# Altium schematic sheet Interfaces.SchDoc: Interfaces
size A3; Author: Valentin Py; DrawnBy: Valentin Py; Engineer: Valentin Py; Address1: valentin.py@gmail.com; SheetNumber: 3; SheetTotal: 5; PageSetup: Record=PageOptions|CenterHorizontal=True|CenterVertical=True|PrintScale=0.24|XCorrection=1.00|YCorrection=1.00|PrintKind=0|BorderSize=5000000|LeftOffset=0|BottomOffset=0|Orientation=2|PaperLength=1000|PaperWidth=1000|Scale=100|PaperSource=7|PrintQuality=-4|MediaType=1|DitherType=10|PaperKind=A4|PrintScaleMode=1
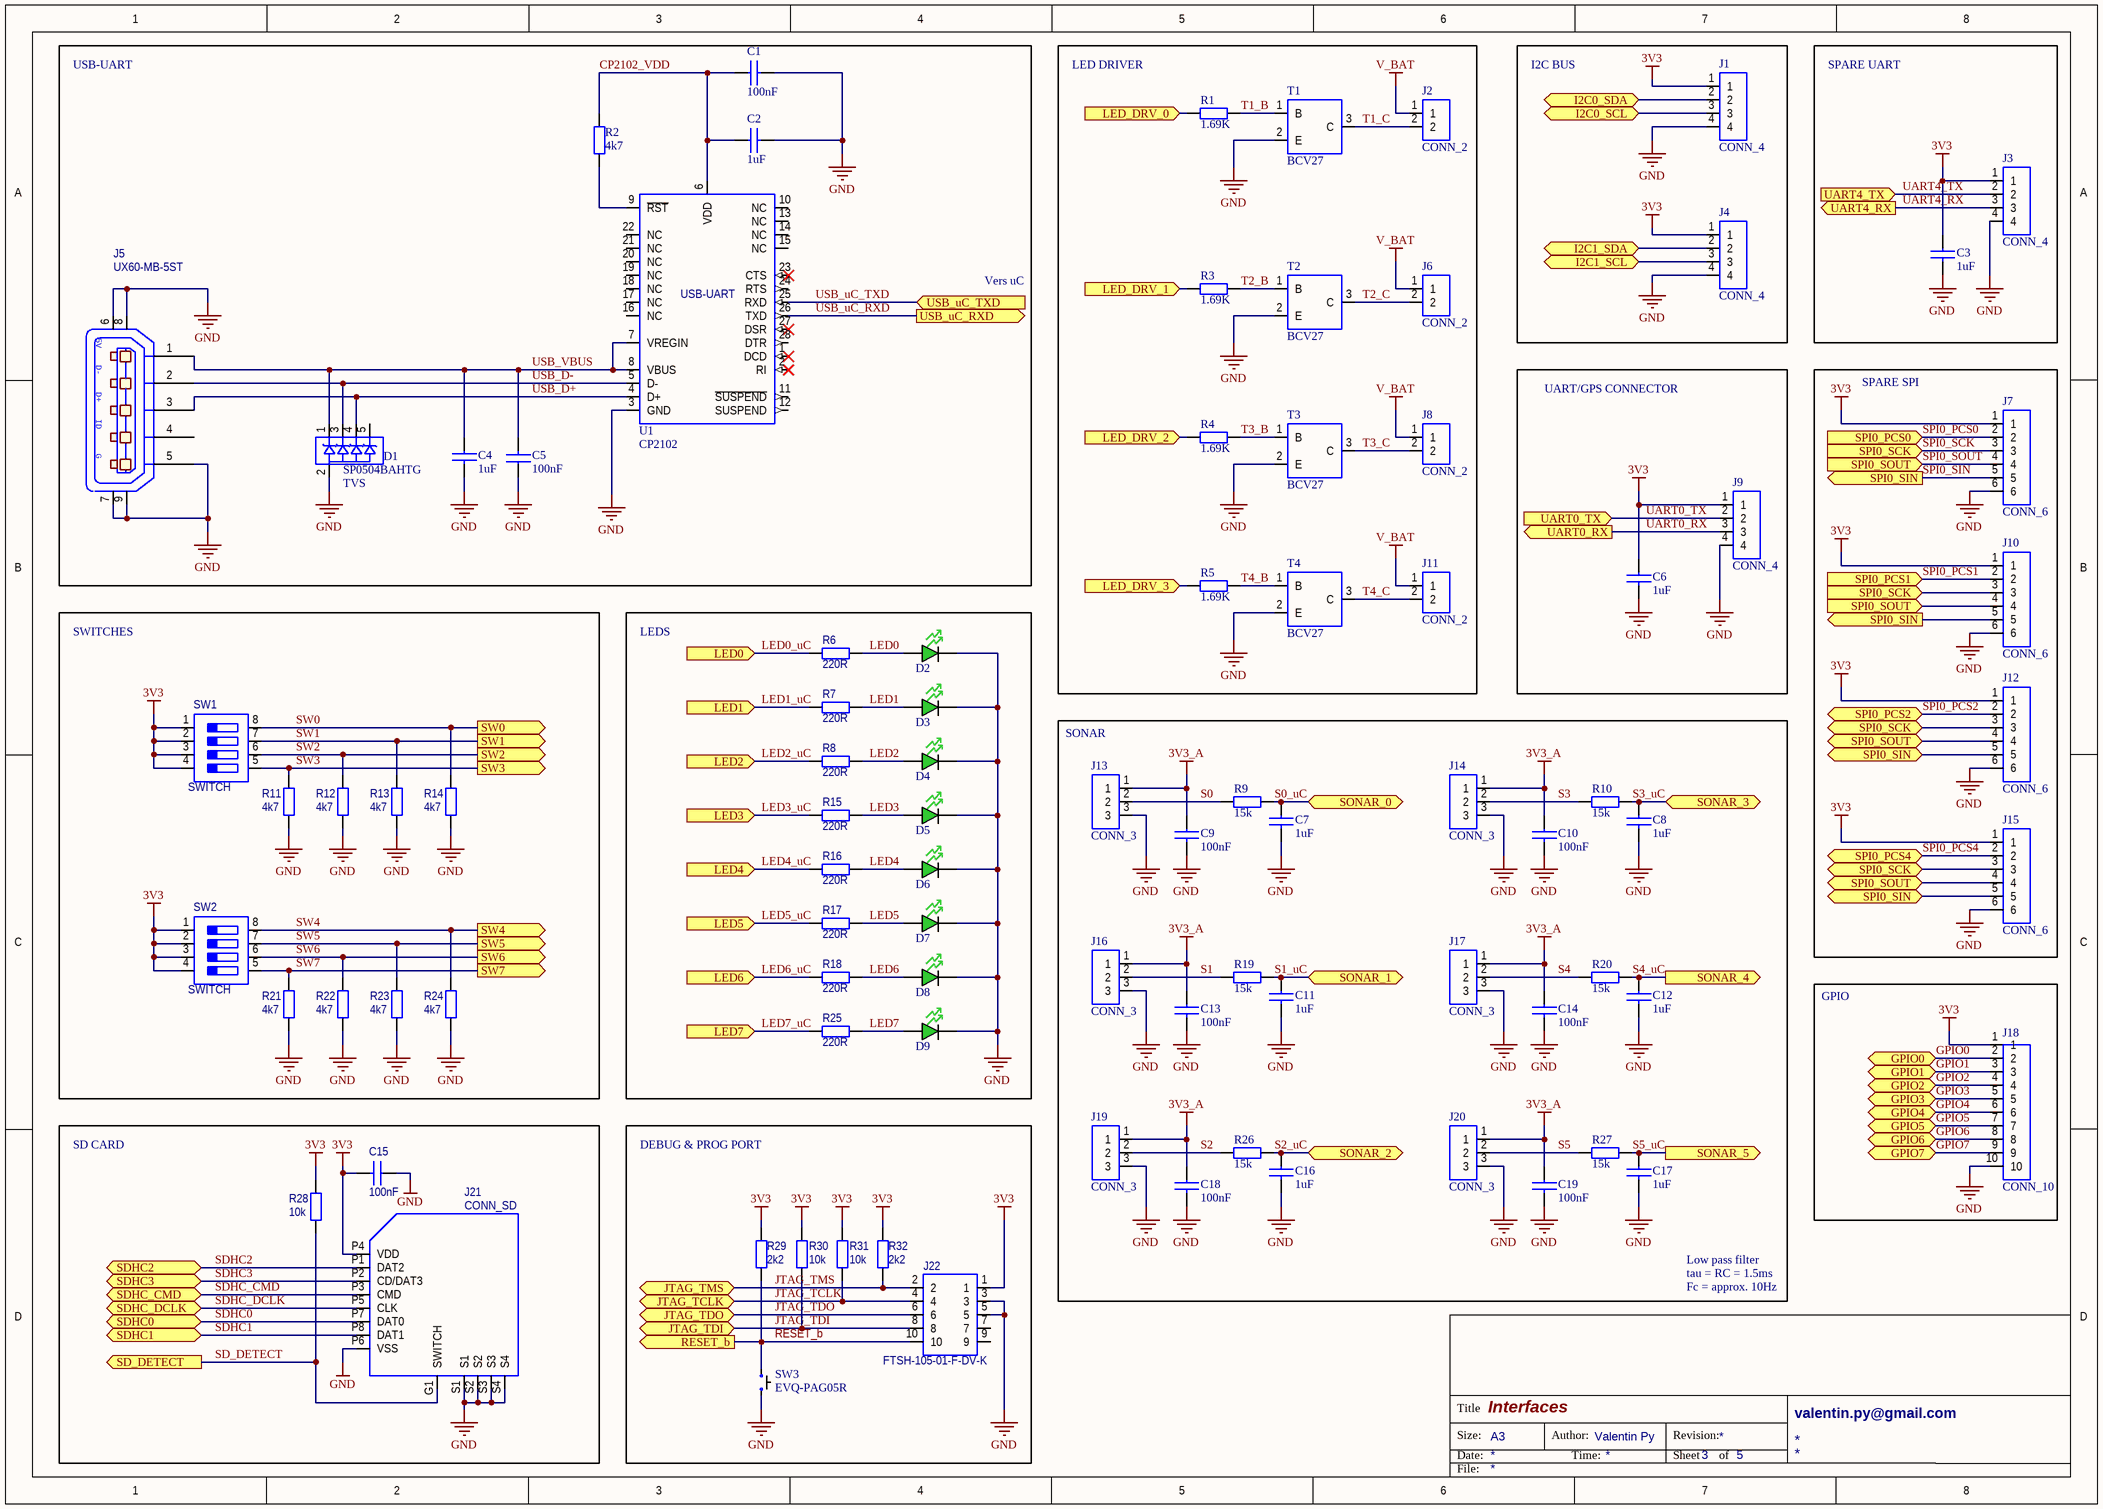
[diagram p0: Interfaces.SchDoc]

## Parts
C1  100nF  [080503]
C2  1uF  [080503]
C3  1uF  [080503]
C4  1uF  [080503]
C5  100nF  [080503]
C6  1uF  [080503]
C7  1uF  [080503]
C8  1uF  [080503]
C9  100nF  [080503]
C10  100nF  [080503]
C11  1uF  [080503]
C12  1uF  [080503]
C13  100nF  [080503]
C14  100nF  [080503]
C15  100nF  [080503]
C16  1uF  [080503]
C17  1uF  [080503]
C18  100nF  [080503]
C19  100nF  [080503]
D1  SP0504BAHTG  [SOT23501]
D2  LED  [LED_0805 - GREEN]  (value not drawn)
D3  LED  [LED_0805 - GREEN]  (value not drawn)
D4  LED  [LED_0805 - GREEN]  (value not drawn)
D5  LED  [LED_0805 - GREEN]  (value not drawn)
D6  LED  [LED_0805 - GREEN]  (value not drawn)
D7  LED  [LED_0805 - GREEN]  (value not drawn)
D8  LED  [LED_0805 - GREEN]  (value not drawn)
D9  LED  [LED_0805 - GREEN]  (value not drawn)
J1  CONN_4  [640454-4]
J2  CONN_2  [640454-2]
J3  CONN_4  [640454-4]
J4  CONN_4  [640454-4]
J5  UX60-MB-5ST  [USB/UX60-MB-5ST]
J6  CONN_2  [640454-2]
J7  CONN_6  [640454-6]
J8  CONN_2  [640454-2]
J9  CONN_4  [640454-4]
J10  CONN_6  [640454-6]
J11  CONN_2  [640454-2]
J12  CONN_6  [640454-6]
J13  CONN_3  [640454-3]
J14  CONN_3  [640454-3]
J15  CONN_6  [640454-6]
J16  CONN_3  [640454-3]
J17  CONN_3  [640454-3]
J18  CONN_10  [640454-10]
J19  CONN_3  [640454-3]
J20  CONN_3  [640454-3]
J21  CONN_SD  [con8_sdcard_push_sm]
J22  FTSH-105-01-F-DV-K  [FTSH-105-01-F-DV-K]
R1  1.69k  [060301]
R2  4k7  [060301]
R3  1.69k  [060301]
R4  1.69k  [060301]
R5  1.69k  [060301]
R6  220R  [060301]
R7  220R  [060301]
R8  220R  [060301]
R9  15k  [060301]
R10  15k  [060301]
R11  4k7  [060301]
R12  4k7  [060301]
R13  4k7  [060301]
R14  4k7  [060301]
R15  220R  [060301]
R16  220R  [060301]
R17  220R  [060301]
R18  220R  [060301]
R19  15k  [060301]
R20  15k  [060301]
R21  4k7  [060301]
R22  4k7  [060301]
R23  4k7  [060301]
R24  4k7  [060301]
R25  220R  [060301]
R26  15k  [060301]
R27  15k  [060301]
R28  10k  [060301]
R29  2k2  [060301]
R30  10k  [060301]
R31  10k  [060301]
R32  2k2  [060301]
SW1  SWITCH  [GDS04]
SW2  SWITCH  [GDS04]
SW3  EVQ-PAG05R  [EVQ-PAG05R]
T1  BCV27  [BCV27]
T2  BCV27  [BCV27]
T3  BCV27  [BCV27]
T4  BCV27  [BCV27]
U1  CP2102  [QFN-28]

## Blocks framed on the sheet
LED DRIVER: J2 J6 J8 J11 R1 R3-R5 T1-T4
I2C BUS: J1 J4
UART/GPS CONNECTOR: C6 J9
SPARE SPI: J7 J10 J12 J15
SWITCHES: R11-R14 R21-R24 SW1 SW2
LEDS: D2-D9 R6-R8 R15-R18 R25
GPIO: J18
SD CARD: C15 J21 R28
DEBUG & PROG PORT: J22 R29-R32 SW3

## Ports
GPIO0 (bidir), GPIO1 (bidir), GPIO2 (bidir), GPIO3 (bidir), GPIO4 (bidir), GPIO5 (bidir), GPIO6 (bidir), GPIO7 (bidir), I2C0_SCL (bidir), I2C0_SDA (bidir), I2C1_SCL, I2C1_SDA, JTAG_TCLK, JTAG_TDI, JTAG_TDO, JTAG_TMS, LED0 (in), LED1 (in), LED2 (in), LED3 (in), LED4 (in), LED5 (in), LED6 (in), LED7 (in), LED_DRV_0 (in), LED_DRV_1 (in), LED_DRV_2 (in), LED_DRV_3 (in), RESET_b (out), SD_DETECT (out), SDHC0, SDHC1, SDHC2, SDHC3, SDHC_CMD, SDHC_DCLK, SONAR_0, SONAR_1, SONAR_2, SONAR_3, SONAR_4 (out), SONAR_5 (out), SPI0_PCS0 (in), SPI0_PCS1 (in), SPI0_PCS2, SPI0_PCS4, SPI0_SCK, SPI0_SCK (in), SPI0_SIN, SPI0_SIN (out), SPI0_SOUT, SPI0_SOUT (in), SW0 (out), SW1 (out), SW2 (out), SW3 (out), SW4 (out), SW5 (out), SW6 (out), SW7 (out), UART0_RX (out), UART0_TX (in), UART4_RX (out), UART4_TX (in), USB_uC_RXD (out), USB_uC_TXD (in)

## Nets
3V3: C3.1 C6.1 C15.2 J1.1 J3.1 J4.1 J7.1 J9.1 J10.1 J12.1 J15.1 J18.1 J21.P4(VDD) J22.1 R28.1 R29.2 R30.1 R31.1 R32.2 SW1.1 SW1.2 SW1.3 SW1.4 SW2.1 SW2.2 SW2.3 SW2.4
3V3_A: C9.1 C10.1 C13.1 C14.1 C18.1 C19.1 J13.1 J14.1 J16.1 J17.1 J19.1 J20.1
GND: C1.2 C2.2 C3.2 C4.2 C5.1 C6.2 C7.2 C8.2 C9.2 C10.2 C11.2 C12.2 C13.2 C14.2 C15.1 C16.2 C17.2 C18.2 C19.2 D1.2 D2.C D3.C D4.C D5.C D6.C D7.C D8.C D9.C J1.4 J3.4 J4.4 J5.5(P5) J5.6(SHLD1) J5.7(SHLD2) J5.8(SHLD3) J5.9(SHLD4) J7.6 J9.4 J10.6 J12.6 J13.3 J14.3 J15.6 J16.3 J17.3 J18.10 J19.3 J20.3 J21.P6(VSS) J21.S1 J21.S2 J21.S3 J21.S4 J22.3 J22.5 R11.1 R12.1 R13.1 R14.1 R21.1 R22.1 R23.1 R24.1 SW3.B T1.2(E) T2.2(E) T3.2(E) T4.2(E) U1.3(GND)
V_BAT: J2.1 J6.1 J8.1 J11.1
CP2102_VDD: C1.1 C2.1 R2.2 U1.6(VDD)
GPIO0: J18.2 ; port GPIO0
GPIO1: J18.3 ; port GPIO1
GPIO2: J18.4 ; port GPIO2
GPIO3: J18.5 ; port GPIO3
GPIO4: J18.6 ; port GPIO4
GPIO5: J18.7 ; port GPIO5
GPIO6: J18.8 ; port GPIO6
GPIO7: J18.9 ; port GPIO7
I2C0_SCL: J1.3 ; port I2C0_SCL
I2C0_SDA: J1.2 ; port I2C0_SDA
I2C1_SCL: J4.3 ; port I2C1_SCL
I2C1_SDA: J4.2 ; port I2C1_SDA
JTAG_TCLK: J22.4 R31.2 ; port JTAG_TCLK
JTAG_TDI: J22.8 R30.2 ; port JTAG_TDI
JTAG_TDO: J22.6 ; port JTAG_TDO
JTAG_TMS: J22.2 R32.1 ; port JTAG_TMS
LED0: D2.A R6.2
LED0_uC: R6.1 ; port LED0
LED1: D3.A R7.2
LED1_uC: R7.1 ; port LED1
LED2: D4.A R8.2
LED2_uC: R8.1 ; port LED2
LED3: D5.A R15.2
LED3_uC: R15.1 ; port LED3
LED4: D6.A R16.2
LED4_uC: R16.1 ; port LED4
LED5: D7.A R17.2
LED5_uC: R17.1 ; port LED5
LED6: D8.A R18.2
LED6_uC: R18.1 ; port LED6
LED7: D9.A R25.2
LED7_uC: R25.1 ; port LED7
LED_DRV_0: R1.1 ; port LED_DRV_0
LED_DRV_1: R3.1 ; port LED_DRV_1
LED_DRV_2: R4.1 ; port LED_DRV_2
LED_DRV_3: R5.1 ; port LED_DRV_3
RESET_b: J22.10 R29.1 SW3.A ; port RESET_b
S0: J13.2 R9.1
S0_uC: C7.1 R9.2 ; port SONAR_0
S1: J16.2 R19.1
S1_uC: C11.1 R19.2 ; port SONAR_1
S2: J19.2 R26.1
S2_uC: C16.1 R26.2 ; port SONAR_2
S3: J14.2 R10.1
S3_uC: C8.1 R10.2 ; port SONAR_3
S4: J17.2 R20.1
S4_uC: C12.1 R20.2 ; port SONAR_4
S5: J20.2 R27.1
S5_uC: C17.1 R27.2 ; port SONAR_5
SD_DETECT: J21.G1(SWITCH) R28.2 ; port SD_DETECT
SDHC0: J21.P7(DAT0) ; port SDHC0
SDHC1: J21.P8(DAT1) ; port SDHC1
SDHC2: J21.P1(DAT2) ; port SDHC2
SDHC3: J21.P2(CD/DAT3) ; port SDHC3
SDHC_CMD: J21.P3(CMD) ; port SDHC_CMD
SDHC_DCLK: J21.P5(CLK) ; port SDHC_DCLK
SPI0_PCS0: J7.2 ; port SPI0_PCS0
SPI0_PCS1: J10.2 ; port SPI0_PCS1
SPI0_PCS2: J12.2 ; port SPI0_PCS2
SPI0_PCS4: J15.2 ; port SPI0_PCS4
SPI0_SCK: J7.3 J10.3 J12.3 J15.3 ; port SPI0_SCK
SPI0_SIN: J7.5 J10.5 J12.5 J15.5 ; port SPI0_SIN
SPI0_SOUT: J7.4 J10.4 J12.4 J15.4 ; port SPI0_SOUT
SW0: R14.2 SW1.8 ; port SW0
SW1: R13.2 SW1.7 ; port SW1
SW2: R12.2 SW1.6 ; port SW2
SW3: R11.2 SW1.5 ; port SW3
SW4: R24.2 SW2.8 ; port SW4
SW5: R23.2 SW2.7 ; port SW5
SW6: R22.2 SW2.6 ; port SW6
SW7: R21.2 SW2.5 ; port SW7
T1_B: R1.2 T1.1(B)
T1_C: J2.2 T1.3(C)
T2_B: R3.2 T2.1(B)
T2_C: J6.2 T2.3(C)
T3_B: R4.2 T3.1(B)
T3_C: J8.2 T3.3(C)
T4_B: R5.2 T4.1(B)
T4_C: J11.2 T4.3(C)
UART0_RX: J9.3 ; port UART0_RX
UART0_TX: J9.2 ; port UART0_TX
UART4_RX: J3.3 ; port UART4_RX
UART4_TX: J3.2 ; port UART4_TX
USB_D+: D1.4 J5.3(P3) U1.4(D+)
USB_D-: D1.3 J5.2(P2) U1.5(D-)
USB_uC_RXD: U1.26(TXD) ; port USB_uC_RXD
USB_uC_TXD: U1.25(RXD) ; port USB_uC_TXD
USB_VBUS: C4.1 C5.2 D1.1 J5.1(P1) U1.7(VREGIN) U1.8(VBUS)
NetR2_1: R2.1 U1.9(~{RST})

Not connected (* = marked no-connect by the designer): D1 5; J5 4(P4); J22 7 9; U1 1(DCD)* 2(RI)* 10(NC) 11(~{SUSPEND}) 12(SUSPEND) 13(NC) 14(NC) 15(NC) 16(NC) 17(NC) 18(NC) 19(NC) 20(NC) 21(NC) 22(NC) 23(CTS)* 24(RTS) 27(DSR)* 28(DTR)

## Notes on the sheet
- USB-UART
- SPARE UART
- Vers uC
- (near D1) TVS
- (near J13) SONAR
- Low pass filter
- tau = RC = 1.5ms
- Fc = approx. 10Hz
- Title
- Size:
- Date:
- A3
- Author:
- Time:
- Revision:
- Sheet
- of
- File:
- (in symbol CP2102) USB-UART
- (in symbol USB_MINI_AB_RECEPTACLE) 5V; D-; D+; ID; G

## Library data of the parts
C1 C5 C9 C10 C13-C15 C18 C19 = CAPA: CAP CER 0.1UF 25V 10% X7R 0805; Value: 100nF; Supplier 1: Digi-Key; Supplier Part Number 1: 1276-1099-1-ND
C2-C4 C6-C8 C11 C12 C16 C17 = CAPA: CAP CER 1UF 25V 10% X7R 0805; Value: 1uF; Supplier 1: Digi-Key; Supplier Part Number 1: 399-1168-1-ND
D1 = SP0504BAHTG: TVS AVAL DIODE ARRAY 4CH, 5.5V; Supplier 1: Digi-Key; Supplier Part Number 1: F3157CT-ND
D2-D9 = APT2012CGCK: LED 2X1.2MM 570NM GN WTR CLR SMD; Supplier 1: Digi-Key; Supplier Part Number 1: 754-1127-1-ND
J2 J6 J8 J11 = CONN_2: CONN HEADER 2.54mm 2; Supplier 1: Stock
J3 J9 = CONN_4: CONN HEADER 2.54mm 4; Supplier 1: Stock
J5 = USB_MINI_AB_RECEPTACLE: CONN RECEPT MINI B USB2.0; Supplier 1: Digi-Key; Supplier Part Number 1: H2959CT-ND
J13 J14 J16 J17 J19 J20 = CONN_3: CONN HEADER 2.54mm 3
  J13 J14 J16 J19: Supplier 1: Stocks
  J17 J20: Supplier 1: Stock
J21 = CON8_SDCARD_SW: CON 8 SD CARD PUSH SMT 1.1MM SP 75H AU; Supplier 1: Digi-Key; Supplier Part Number 1: WM6825CT-ND
J22 = CON10A: CONN HEADER 10POS DUAL .05" SMD; Supplier 1: Digi-Key; Supplier Part Number 1: FTSH-105-01-F-DV-K-ND
R1 R3-R5 = RES: RES 1.69K OHM 1% 1/8W 0805; Value: 1.69K; Supplier 1: Digi-Key; Supplier Part Number 1: P1.69KHCT-ND
R2 R11-R14 R21-R24 = RES: RES 4.7K 0805; Value: 4k7; Supplier 1: Digi-Key; Supplier Part Number 1: RMCF0603FT4K70CT-ND
R6-R8 R15-R18 R25 = RES: RES 220R 0805; Value: 220R; Supplier 1: Digi-Key; Supplier Part Number 1: RMCF0603FT220RCT-ND
R9 R10 R19 R20 R26 R27 = RES: RES 15K 0805; Value: 15k; Supplier 1: Digi-Key; Supplier Part Number 1: RHM15.0KCFCT-ND
R28 R30 R31 = RES: RES 10K 0805; Value: 10k; Supplier 1: Digi-Key; Supplier Part Number 1: RHM10.0KCFCT-ND
R29 R32 = RES: RES 2.2k 0805; Value: 2k2; Supplier 1: Digi-Key; Supplier Part Number 1: RMCF0603FT2K20CT-ND
SW1 SW2 = SW DIP-4: SWITCH DIP TOP SLIDE 4POS SMD; Supplier 1: Digi-Key; Supplier Part Number 1: CKN6068-ND
SW3 = EVQ-PAG05R: SWITCH LT 6MM 260GF 5MM HEIGHT; Value: EVQ-PAG05R; Supplier 1: Digi-Key; Supplier Part Number 1: P12195S-ND
T1-T4 = BCV27: TRANS NPN DARL 30V 1.2A SOT23; Supplier 1: Digi-Key; Supplier Part Number 1: BCV27CT-ND
U1 = CP2102: Single-Chip USB to UART Bridge; Value: *; Supplier 1: Digi-Key; Supplier Part Number 1: 336-1160-5-ND